# Altium schematic sheet con-left-bot.SchDoc: CS - Left Bottom
size Letter; CheckedBy: J. Brinton; CompanyName: Signal Laboratories, Inc.; DrawnBy: J. Brinton; Engineer: J. Brinton; Address1: 3479 Edison Way; Address2: Menlo Park CA 94025; Address3: +1 (877) 778-8435; Address4: siglabs.com; Revision: 3; SheetNumber: 35; SheetTotal: 47
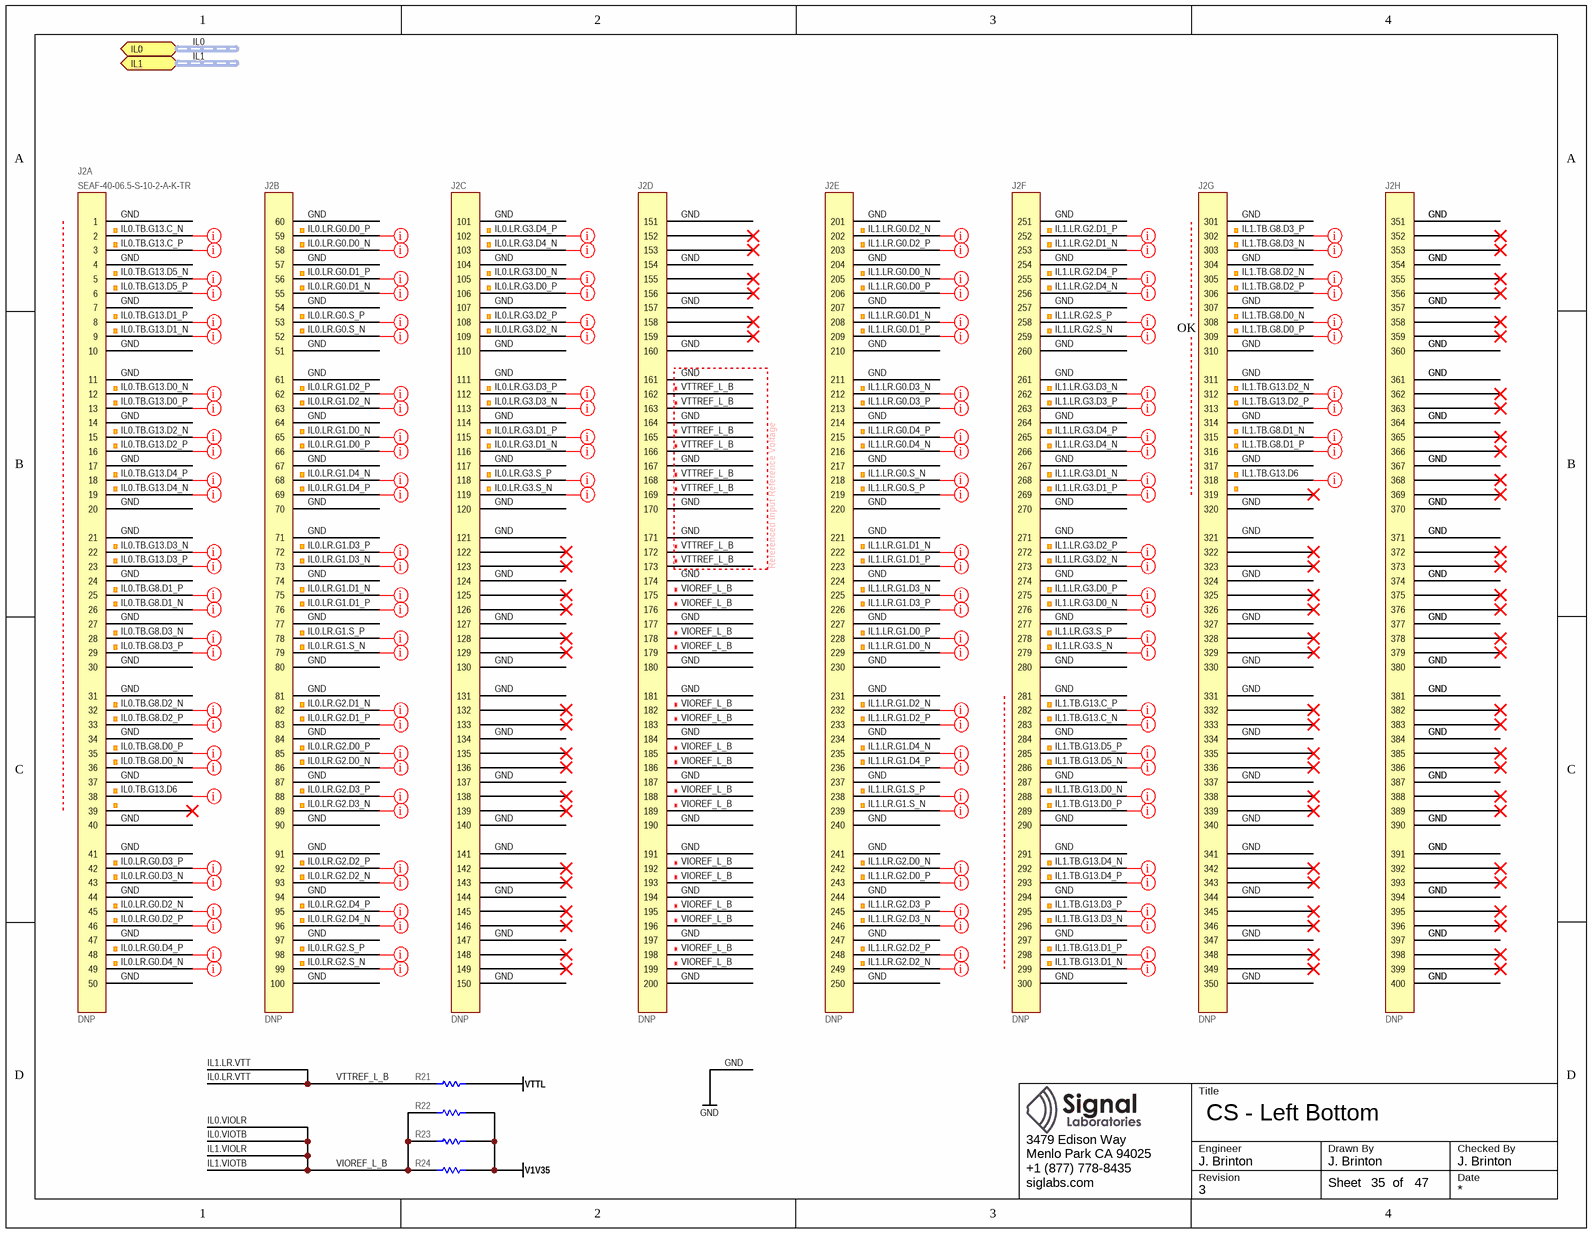
[diagram p0: con-left-bot.SchDoc]

## Parts
J2  SEAF-40-06.5-S-10-2-A-K-TR  Do Not Place: DNP  [SEAF-40-06.5-S-10-2-A-K-TR]  (parts A,B,C,D,E,F,G,H of 8)
R21  SOLDER_LINK  [SOLDERLINK0603X26N]  (value not drawn)  (no BOM)
R22  SOLDER_LINK  [SOLDERLINK0603X26N]  (value not drawn)  (no BOM)
R23  SOLDER_LINK  [SOLDERLINK0603X26N]  (value not drawn)  (no BOM)
R24  SOLDER_LINK  [SOLDERLINK0603X26N]  (value not drawn)  (no BOM)

## Ports
IL0 (harness IL), IL1 (harness IL)

## Nets
GND: J2.1 J2.4 J2.7 J2.10 J2.11 J2.14 J2.17 J2.20 J2.21 J2.24 J2.27 J2.30 J2.31 J2.34 J2.37 J2.40 J2.41 J2.44 J2.47 J2.50 J2.51 J2.54 J2.57 J2.60 J2.61 J2.64 J2.67 J2.70 J2.71 J2.74 J2.77 J2.80 J2.81 J2.84 J2.87 J2.90 J2.91 J2.94 J2.97 J2.100 J2.101 J2.104 J2.107 J2.110 J2.111 J2.114 J2.117 J2.120 J2.121 J2.124 J2.127 J2.130 J2.131 J2.134 J2.137 J2.140 J2.141 J2.144 J2.147 J2.150 J2.151 J2.154 J2.157 J2.160 J2.161 J2.164 J2.167 J2.170 J2.171 J2.174 J2.177 J2.180 J2.181 J2.184 J2.187 J2.190 J2.191 J2.194 J2.197 J2.200 J2.201 J2.204 J2.207 J2.210 J2.211 J2.214 J2.217 J2.220 J2.221 J2.224 J2.227 J2.230 J2.231 J2.234 J2.237 J2.240 J2.241 J2.244 J2.247 J2.250 J2.251 J2.254 J2.257 J2.260 J2.261 J2.264 J2.267 J2.270 J2.271 J2.274 J2.277 J2.280 J2.281 J2.284 J2.287 J2.290 J2.291 J2.294 J2.297 J2.300 J2.301 J2.304 J2.307 J2.310 J2.311 J2.314 J2.317 J2.320 J2.321 J2.324 J2.327 J2.330 J2.331 J2.334 J2.337 J2.340 J2.341 J2.344 J2.347 J2.350 J2.351 J2.354 J2.357 J2.360 J2.361 J2.364 J2.367 J2.370 J2.371 J2.374 J2.377 J2.380 J2.381 J2.384 J2.387 J2.390 J2.391 J2.394 J2.397 J2.400
V1V35: R22.1 R23.1 R24.1
VTTL: R21.1
IL0.LR.G0.D0_N: J2.58
IL0.LR.G0.D0_P: J2.59
IL0.LR.G0.D1_N: J2.55
IL0.LR.G0.D1_P: J2.56
IL0.LR.G0.D2_N: J2.45
IL0.LR.G0.D2_P: J2.46
IL0.LR.G0.D3_N: J2.43
IL0.LR.G0.D3_P: J2.42
IL0.LR.G0.D4_N: J2.49
IL0.LR.G0.D4_P: J2.48
IL0.LR.G0.S_N: J2.52
IL0.LR.G0.S_P: J2.53
IL0.LR.G1.D0_N: J2.65
IL0.LR.G1.D0_P: J2.66
IL0.LR.G1.D1_N: J2.75
IL0.LR.G1.D1_P: J2.76
IL0.LR.G1.D2_N: J2.63
IL0.LR.G1.D2_P: J2.62
IL0.LR.G1.D3_N: J2.73
IL0.LR.G1.D3_P: J2.72
IL0.LR.G1.D4_N: J2.68
IL0.LR.G1.D4_P: J2.69
IL0.LR.G1.S_N: J2.79
IL0.LR.G1.S_P: J2.78
IL0.LR.G2.D0_N: J2.86
IL0.LR.G2.D0_P: J2.85
IL0.LR.G2.D1_N: J2.82
IL0.LR.G2.D1_P: J2.83
IL0.LR.G2.D2_N: J2.93
IL0.LR.G2.D2_P: J2.92
IL0.LR.G2.D3_N: J2.89
IL0.LR.G2.D3_P: J2.88
IL0.LR.G2.D4_N: J2.96
IL0.LR.G2.D4_P: J2.95
IL0.LR.G2.S_N: J2.99
IL0.LR.G2.S_P: J2.98
IL0.LR.G3.D0_N: J2.105
IL0.LR.G3.D0_P: J2.106
IL0.LR.G3.D1_N: J2.116
IL0.LR.G3.D1_P: J2.115
IL0.LR.G3.D2_N: J2.109
IL0.LR.G3.D2_P: J2.108
IL0.LR.G3.D3_N: J2.113
IL0.LR.G3.D3_P: J2.112
IL0.LR.G3.D4_N: J2.103
IL0.LR.G3.D4_P: J2.102
IL0.LR.G3.S_N: J2.119
IL0.LR.G3.S_P: J2.118
IL0.LR.VTT: J2.162 J2.163 J2.165 J2.166 J2.168 J2.169 J2.172 J2.173 R21.2  [also labelled IL1.LR.VTT, VTTREF_L_B]
IL0.TB.G8.D0_N: J2.36
IL0.TB.G8.D0_P: J2.35
IL0.TB.G8.D1_N: J2.26
IL0.TB.G8.D1_P: J2.25
IL0.TB.G8.D2_N: J2.32
IL0.TB.G8.D2_P: J2.33
IL0.TB.G8.D3_N: J2.28
IL0.TB.G8.D3_P: J2.29
IL0.TB.G13.C_N: J2.2
IL0.TB.G13.C_P: J2.3
IL0.TB.G13.D0_N: J2.12
IL0.TB.G13.D0_P: J2.13
IL0.TB.G13.D1_N: J2.9
IL0.TB.G13.D1_P: J2.8
IL0.TB.G13.D2_N: J2.15
IL0.TB.G13.D2_P: J2.16
IL0.TB.G13.D3_N: J2.22
IL0.TB.G13.D3_P: J2.23
IL0.TB.G13.D4_N: J2.19
IL0.TB.G13.D4_P: J2.18
IL0.TB.G13.D5_N: J2.5
IL0.TB.G13.D5_P: J2.6
IL0.TB.G13.D6: J2.38
IL0.VIOLR: J2.175 J2.176 J2.178 J2.179 J2.182 J2.183 J2.185 J2.186 J2.188 J2.189 J2.192 J2.193 J2.195 J2.196 J2.198 J2.199 R22.2 R23.2 R24.2  [also labelled IL0.VIOTB, IL1.VIOLR, IL1.VIOTB, VIOREF_L_B]
IL1.LR.G0.D0_N: J2.205
IL1.LR.G0.D0_P: J2.206
IL1.LR.G0.D1_N: J2.208
IL1.LR.G0.D1_P: J2.209
IL1.LR.G0.D2_N: J2.202
IL1.LR.G0.D2_P: J2.203
IL1.LR.G0.D3_N: J2.212
IL1.LR.G0.D3_P: J2.213
IL1.LR.G0.D4_N: J2.216
IL1.LR.G0.D4_P: J2.215
IL1.LR.G0.S_N: J2.218
IL1.LR.G0.S_P: J2.219
IL1.LR.G1.D0_N: J2.229
IL1.LR.G1.D0_P: J2.228
IL1.LR.G1.D1_N: J2.222
IL1.LR.G1.D1_P: J2.223
IL1.LR.G1.D2_N: J2.232
IL1.LR.G1.D2_P: J2.233
IL1.LR.G1.D3_N: J2.225
IL1.LR.G1.D3_P: J2.226
IL1.LR.G1.D4_N: J2.235
IL1.LR.G1.D4_P: J2.236
IL1.LR.G1.S_N: J2.239
IL1.LR.G1.S_P: J2.238
IL1.LR.G2.D0_N: J2.242
IL1.LR.G2.D0_P: J2.243
IL1.LR.G2.D1_N: J2.253
IL1.LR.G2.D1_P: J2.252
IL1.LR.G2.D2_N: J2.249
IL1.LR.G2.D2_P: J2.248
IL1.LR.G2.D3_N: J2.246
IL1.LR.G2.D3_P: J2.245
IL1.LR.G2.D4_N: J2.256
IL1.LR.G2.D4_P: J2.255
IL1.LR.G2.S_N: J2.259
IL1.LR.G2.S_P: J2.258
IL1.LR.G3.D0_N: J2.276
IL1.LR.G3.D0_P: J2.275
IL1.LR.G3.D1_N: J2.268
IL1.LR.G3.D1_P: J2.269
IL1.LR.G3.D2_N: J2.273
IL1.LR.G3.D2_P: J2.272
IL1.LR.G3.D3_N: J2.262
IL1.LR.G3.D3_P: J2.263
IL1.LR.G3.D4_N: J2.266
IL1.LR.G3.D4_P: J2.265
IL1.LR.G3.S_N: J2.279
IL1.LR.G3.S_P: J2.278
IL1.TB.G8.D0_N: J2.308
IL1.TB.G8.D0_P: J2.309
IL1.TB.G8.D1_N: J2.315
IL1.TB.G8.D1_P: J2.316
IL1.TB.G8.D2_N: J2.305
IL1.TB.G8.D2_P: J2.306
IL1.TB.G8.D3_N: J2.303
IL1.TB.G8.D3_P: J2.302
IL1.TB.G13.C_N: J2.283
IL1.TB.G13.C_P: J2.282
IL1.TB.G13.D0_N: J2.288
IL1.TB.G13.D0_P: J2.289
IL1.TB.G13.D1_N: J2.299
IL1.TB.G13.D1_P: J2.298
IL1.TB.G13.D2_N: J2.312
IL1.TB.G13.D2_P: J2.313
IL1.TB.G13.D3_N: J2.296
IL1.TB.G13.D3_P: J2.295
IL1.TB.G13.D4_N: J2.292
IL1.TB.G13.D4_P: J2.293
IL1.TB.G13.D5_N: J2.286
IL1.TB.G13.D5_P: J2.285
IL1.TB.G13.D6: J2.318

Not connected (* = marked no-connect by the designer): J2 39* 122* 123* 125* 126* 128* 129* 132* 133* 135* 136* 138* 139* 142* 143* 145* 146* 148* 149* 152* 153* 155* 156* 158* 159* 319* 322* 323* 325* 326* 328* 329* 332* 333* 335* 336* 338* 339* 342* 343* 345* 346* 348* 349* 352* 353* 355* 356* 358* 359* 362* 363* 365* 366* 368* 369* 372* 373* 375* 376* 378* 379* 382* 383* 385* 386* 388* 389* 392* 393* 395* 396* 398* 399*

## Buses and harness runs
harness IL0 = port IL0
harness IL1 = port IL1

## Layout directives
net class z50; differential pair; net class loose: IL0.LR.G0.D0_N, IL0.LR.G0.D0_P, IL0.LR.G0.D1_N, IL0.LR.G0.D1_P, IL0.LR.G0.D2_N, IL0.LR.G0.D2_P, IL0.LR.G0.D3_N, IL0.LR.G0.D3_P, IL0.LR.G0.D4_N, IL0.LR.G0.D4_P, IL0.LR.G0.S_N, IL0.LR.G0.S_P, IL0.LR.G1.D0_N, IL0.LR.G1.D0_P, IL0.LR.G1.D1_N, IL0.LR.G1.D1_P, IL0.LR.G1.D2_N, IL0.LR.G1.D2_P, IL0.LR.G1.D3_N, IL0.LR.G1.D3_P, IL0.LR.G1.D4_N, IL0.LR.G1.D4_P, IL0.LR.G1.S_N, IL0.LR.G1.S_P, IL0.LR.G2.D0_N, IL0.LR.G2.D0_P, IL0.LR.G2.D1_N, IL0.LR.G2.D1_P, IL0.LR.G2.D2_N, IL0.LR.G2.D2_P, IL0.LR.G2.D3_N, IL0.LR.G2.D3_P, IL0.LR.G2.D4_N, IL0.LR.G2.D4_P, IL0.LR.G2.S_N, IL0.LR.G2.S_P, IL0.LR.G3.D0_N, IL0.LR.G3.D0_P, IL0.LR.G3.D1_N, IL0.LR.G3.D1_P, IL0.LR.G3.D2_N, IL0.LR.G3.D2_P, IL0.LR.G3.D3_N, IL0.LR.G3.D3_P, IL0.LR.G3.D4_N, IL0.LR.G3.D4_P, IL0.LR.G3.S_N, IL0.LR.G3.S_P, IL0.TB.G8.D0_N, IL0.TB.G8.D0_P, IL0.TB.G8.D1_N, IL0.TB.G8.D1_P, IL0.TB.G8.D2_N, IL0.TB.G8.D2_P, IL0.TB.G8.D3_N, IL0.TB.G8.D3_P, IL0.TB.G13.C_N, IL0.TB.G13.C_P, IL0.TB.G13.D0_N, IL0.TB.G13.D0_P, IL0.TB.G13.D1_N, IL0.TB.G13.D1_P, IL0.TB.G13.D2_N, IL0.TB.G13.D2_P, IL0.TB.G13.D3_N, IL0.TB.G13.D3_P, IL0.TB.G13.D4_N, IL0.TB.G13.D4_P, IL0.TB.G13.D5_N, IL0.TB.G13.D5_P, IL1.LR.G0.D0_N, IL1.LR.G0.D0_P, IL1.LR.G0.D1_N, IL1.LR.G0.D1_P, IL1.LR.G0.D2_N, IL1.LR.G0.D2_P, IL1.LR.G0.D3_N, IL1.LR.G0.D3_P, IL1.LR.G0.D4_N, IL1.LR.G0.D4_P, IL1.LR.G0.S_N, IL1.LR.G0.S_P, IL1.LR.G1.D0_N, IL1.LR.G1.D0_P, IL1.LR.G1.D1_N, IL1.LR.G1.D1_P, IL1.LR.G1.D2_N, IL1.LR.G1.D2_P, IL1.LR.G1.D3_N, IL1.LR.G1.D3_P, IL1.LR.G1.D4_N, IL1.LR.G1.D4_P, IL1.LR.G1.S_N, IL1.LR.G1.S_P, IL1.LR.G2.D0_N, IL1.LR.G2.D0_P, IL1.LR.G2.D1_N, IL1.LR.G2.D1_P, IL1.LR.G2.D2_N, IL1.LR.G2.D2_P, IL1.LR.G2.D3_N, IL1.LR.G2.D3_P, IL1.LR.G2.D4_N, IL1.LR.G2.D4_P, IL1.LR.G2.S_N, IL1.LR.G2.S_P, IL1.LR.G3.D0_N, IL1.LR.G3.D0_P, IL1.LR.G3.D1_N, IL1.LR.G3.D1_P, IL1.LR.G3.D2_N, IL1.LR.G3.D2_P, IL1.LR.G3.D3_N, IL1.LR.G3.D3_P, IL1.LR.G3.D4_N, IL1.LR.G3.D4_P, IL1.LR.G3.S_N, IL1.LR.G3.S_P, IL1.TB.G8.D0_N, IL1.TB.G8.D0_P, IL1.TB.G8.D1_N, IL1.TB.G8.D1_P, IL1.TB.G8.D2_N, IL1.TB.G8.D2_P, IL1.TB.G8.D3_N, IL1.TB.G8.D3_P, IL1.TB.G13.C_N, IL1.TB.G13.C_P, IL1.TB.G13.D0_N, IL1.TB.G13.D0_P, IL1.TB.G13.D1_N, IL1.TB.G13.D1_P, IL1.TB.G13.D2_N, IL1.TB.G13.D2_P, IL1.TB.G13.D3_N, IL1.TB.G13.D3_P, IL1.TB.G13.D4_N, IL1.TB.G13.D4_P, IL1.TB.G13.D5_N, IL1.TB.G13.D5_P
net class z50: IL0.TB.G13.D6, IL1.TB.G13.D6

## Notes on the sheet
- (near J2) OK
- Referenced Input Reference Voltage
- Title
- Engineer
- Revision
- Drawn By
- Checked By
- Date
- Sheet
- of

## Library data of the parts
J2 = SEAF-40-06.5-S-10-2-A-K-TR: Terminal Array Assembly, Surface Mount, 0.050" Pitch, 400 Pins; Manufacturer: Samtec; Manufacturer P/N: SEAF-40-06.5-S-10-2-A-K-TR
R21-R24 = RES: Solder Link; Manufacturer P/N: *; Manufacturer: *